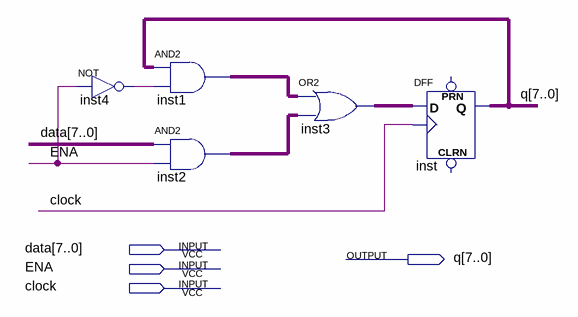
[diagram p0: schematic sheet]
// Quartus schematic jcq8.bdf as structural Verilog: 5 symbols, 4 pins
module jcq8 (
  input  [7:0] data,
  input  ENA,
  input  clock,
  output [7:0] q
);

  wire inst4_out;
  wire [7:0] inst1_out, inst2_out, inst3_out;

  not inst4 (inst4_out, ENA);
  assign inst1_out = q & {8{inst4_out}};  // AND2 inst1, 8 bits wide
  assign inst2_out = data & {8{ENA}};  // AND2 inst2, 8 bits wide
  assign inst3_out = inst1_out | inst2_out;  // OR2 inst3, 8 bits wide
  DFF inst[7:0] (.CLK(clock), .D(inst3_out), .Q(q));  // open: CLRN, PRN
endmodule
